# EAGLE schematic GF130nm (EAGLE 9.5.2)
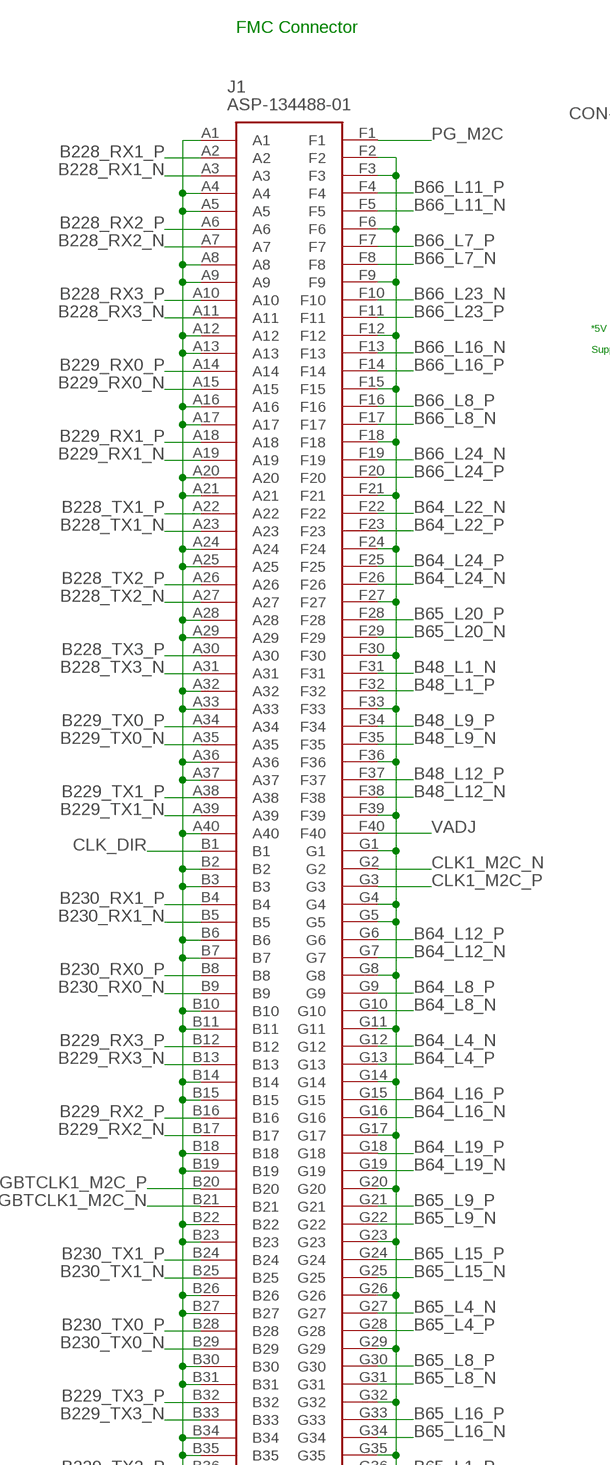
[diagram p0: schematic, sheet 1, part 1 of 3]
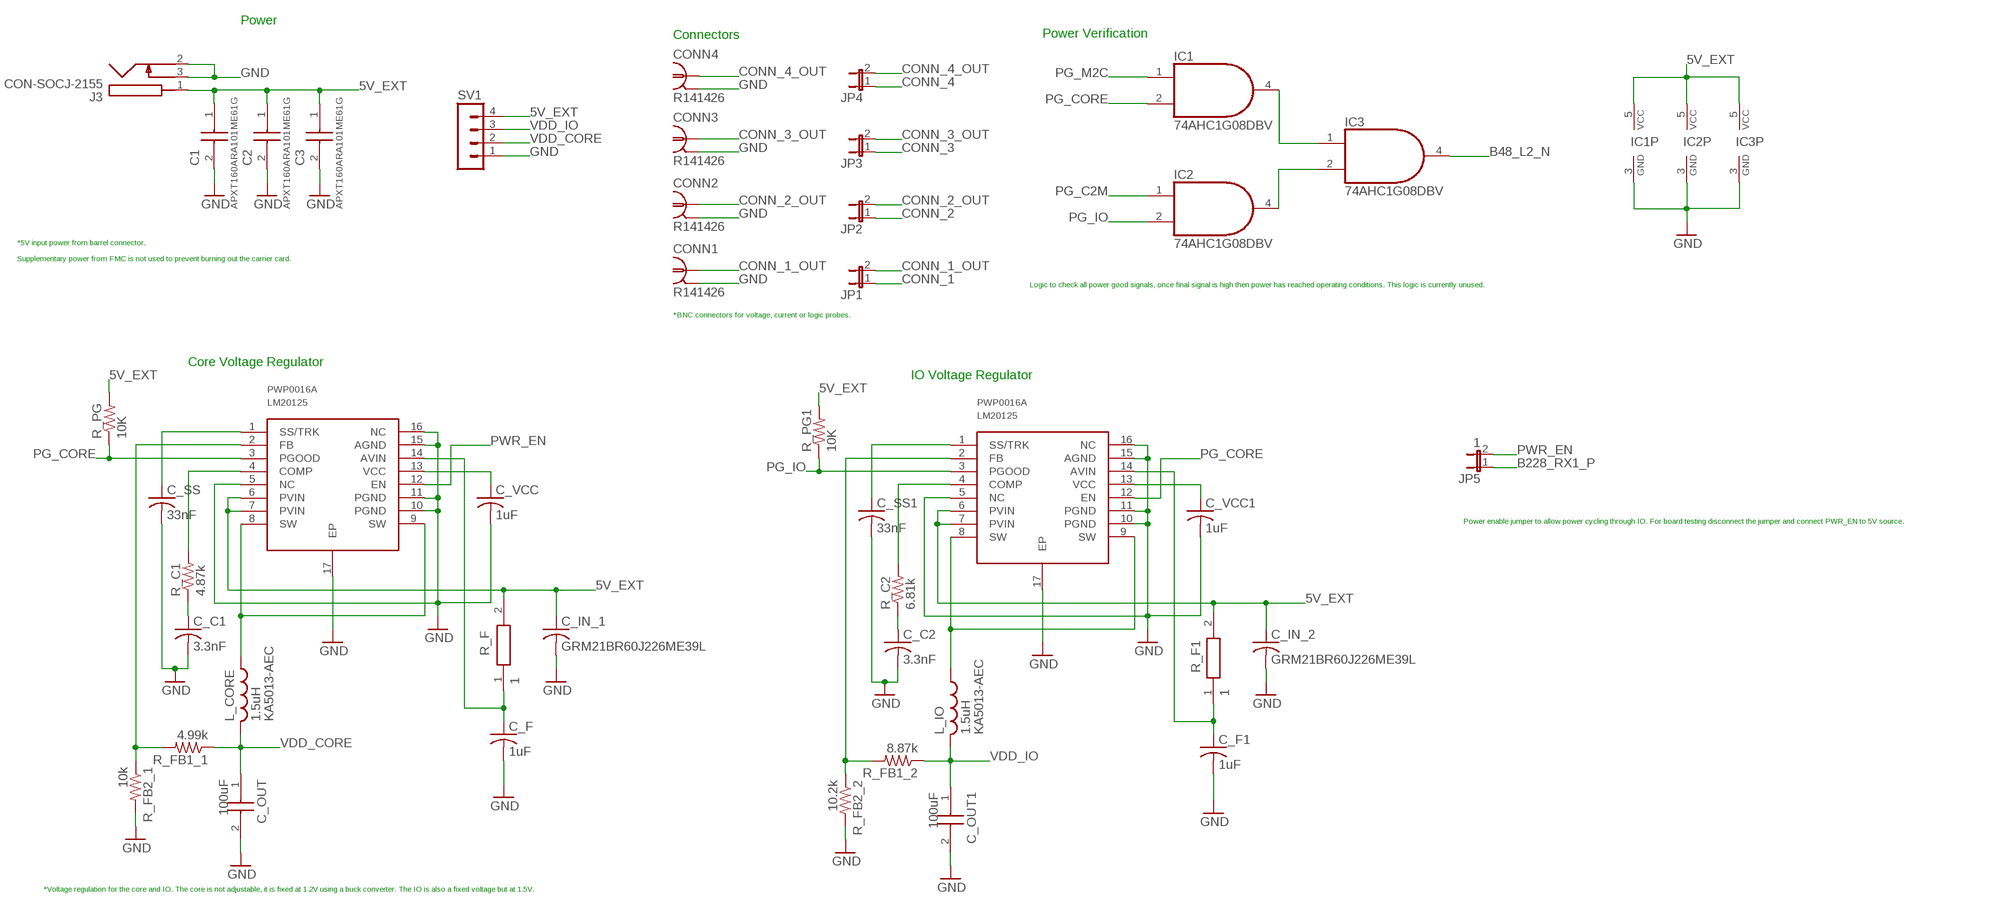
[diagram p1: schematic, sheet 1, part 2 of 3]
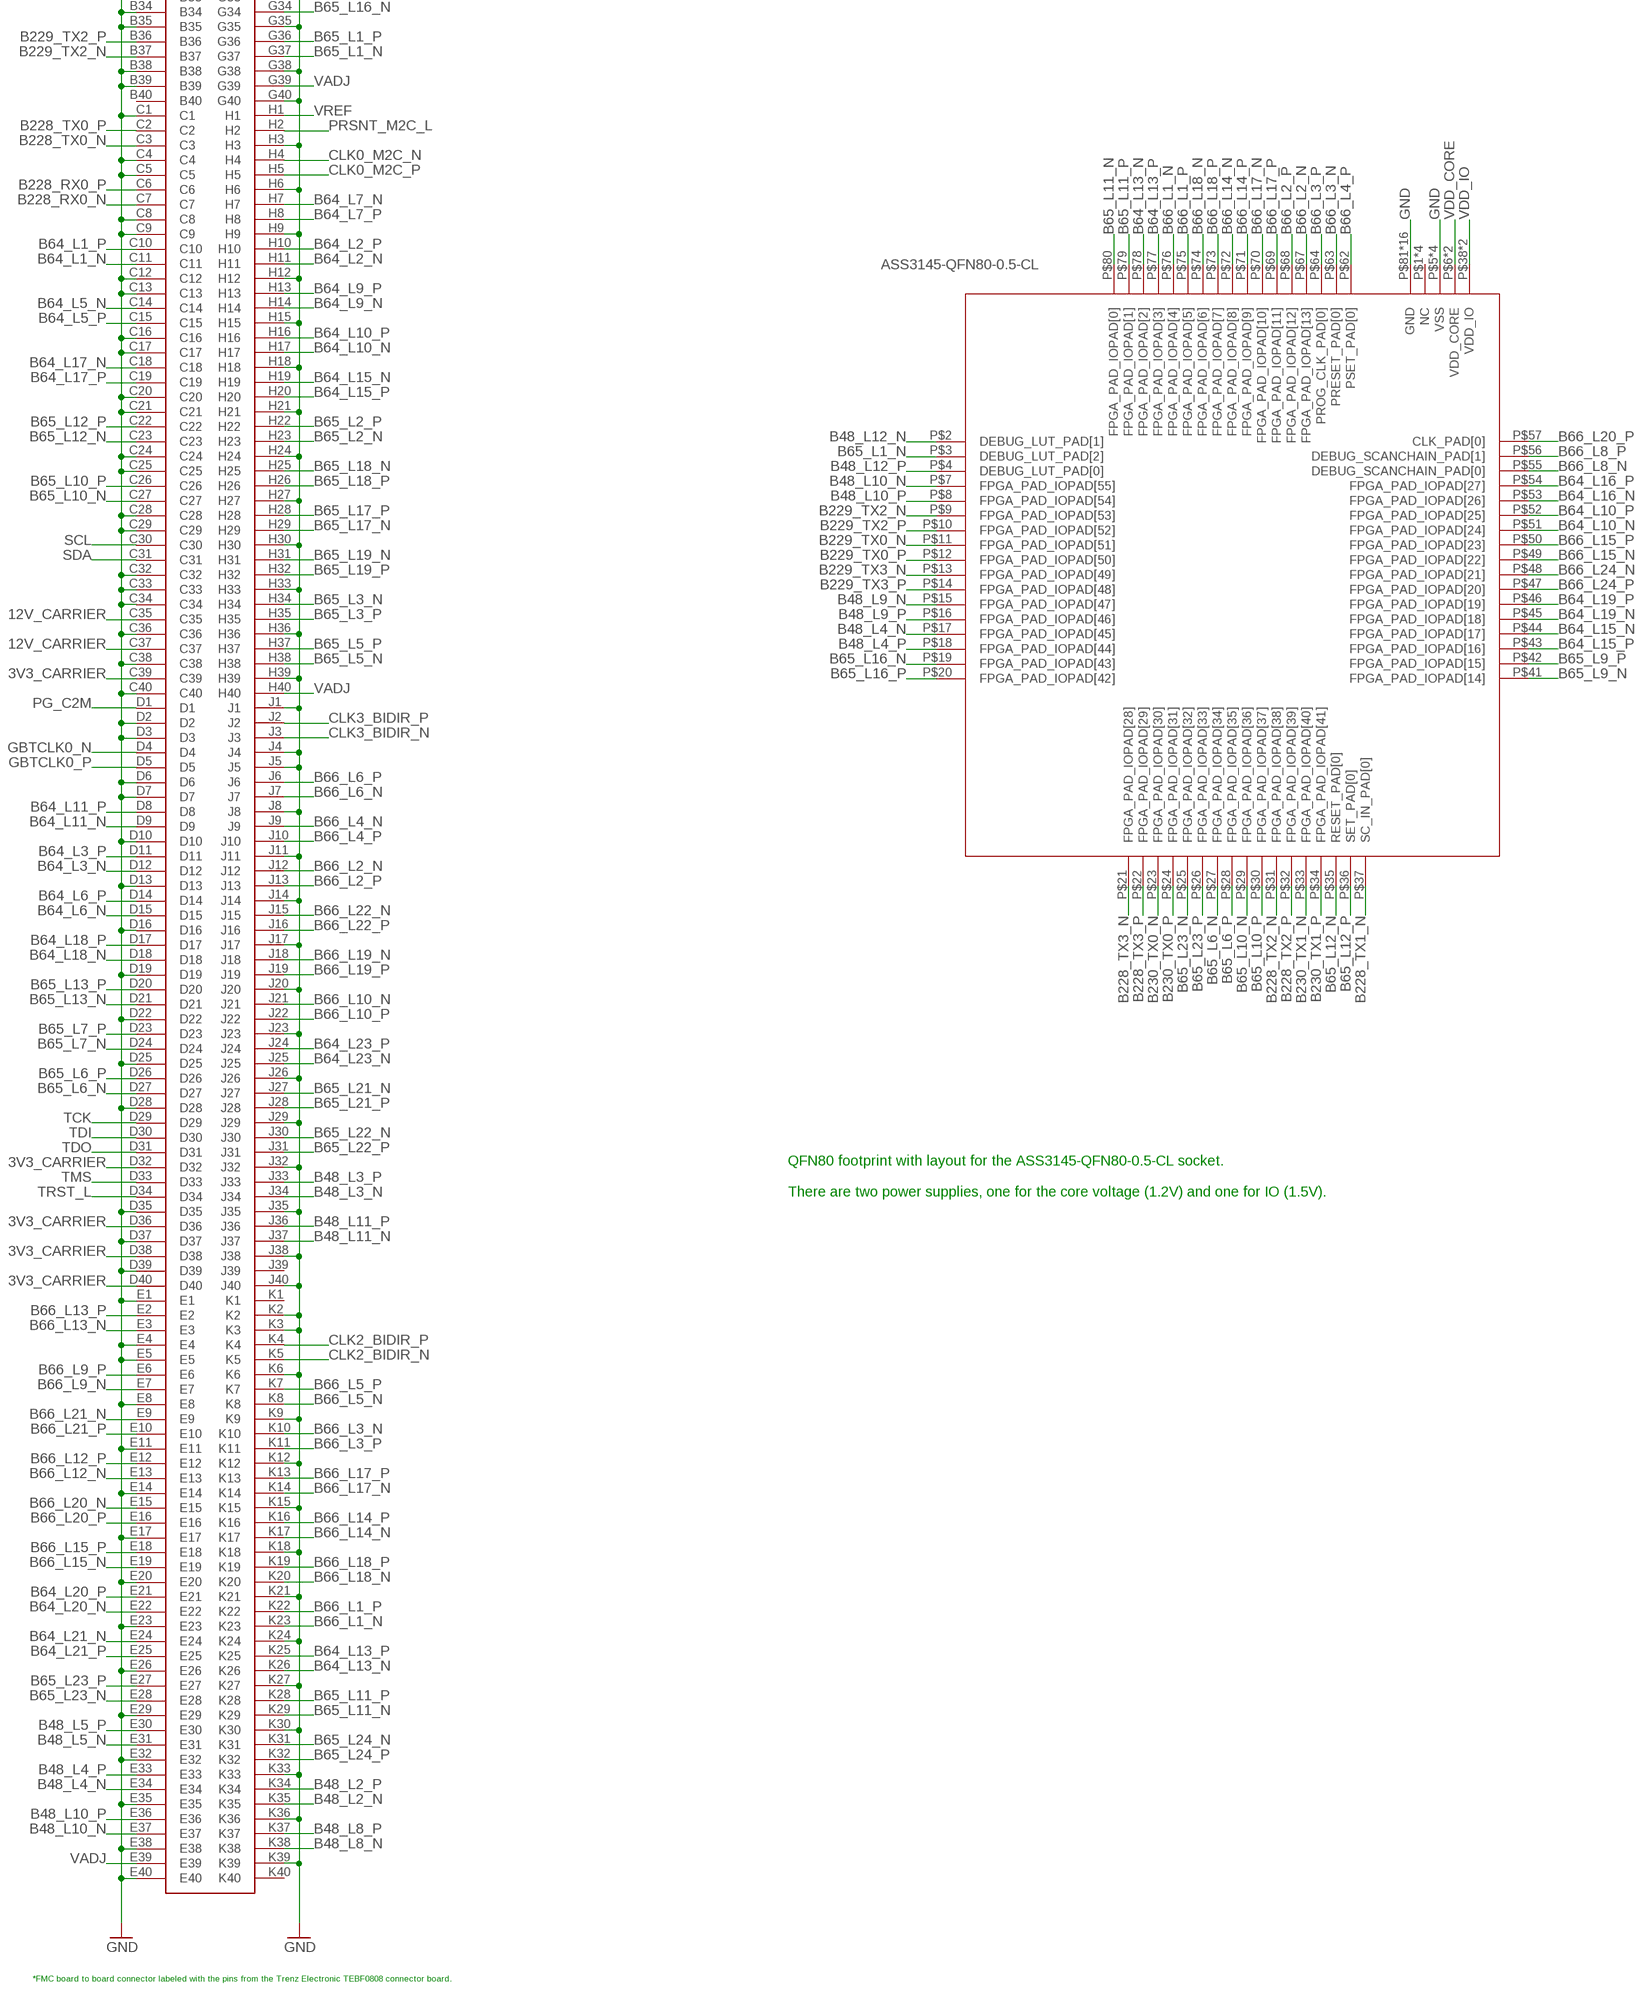
[diagram p2: schematic, sheet 1, part 3 of 3]

## Parts
C1  APXT160ARA101ME61G  [CAPAE530X610N]
C2  APXT160ARA101ME61G  [CAPAE530X610N]
C3  APXT160ARA101ME61G  [CAPAE530X610N]
C_C1  3.3nF  C-USC0805  [C0805]
C_C2  3.3nF  C-USC0805  [C0805]
C_F  1uF  C-USC0805  [C0805]
C_F1  1uF  C-USC0805  [C0805]
C_IN_1  GRM21BR60J226ME39L  [CAPC2012X125N]
C_IN_2  GRM21BR60J226ME39L  [CAPC2012X125N]
C_OUT  100uF  GRM21BR60J107ME15L  [CAPC2012X145N]
C_OUT1  100uF  GRM21BR60J107ME15L  [CAPC2012X145N]
C_SS  33nF  C-USC0805  [C0805]
C_SS1  33nF  C-USC0805  [C0805]
C_VCC  1uF  C-USC0805  [C0805]
C_VCC1  1uF  C-USC0805  [C0805]
CONN1  R141426  [R141426]
CONN2  R141426  [R141426]
CONN3  R141426  [R141426]
CONN4  R141426  [R141426]
IC1  74AHC1G08DBV  [SOT23-5]
IC2  74AHC1G08DBV  [SOT23-5]
IC3  74AHC1G08DBV  [SOT23-5]
J1  ASP-134488-01  [ASP13448801]
J3  CON-SOCJ-2155  [CONSOCJ2155]
JP1  JP1E  [JP1]
JP2  JP1E  [JP1]
JP3  JP1E  [JP1]
JP4  JP1E  [JP1]
JP5  1  JP1E  [JP1]
L_CORE  KA5013-AEC  [INDDFN400X400X180-2N]
L_IO  KA5013-AEC  [INDDFN400X400X180-2N]
R_C1  4.87k  R-US_R0805  [R0805]
R_C2  6.81k  R-US_R0805  [R0805]
R_F  1  RT0603BRD071RL  [RESC1608X55N]
R_F1  1  RT0603BRD071RL  [RESC1608X55N]
R_FB1_1  4.99k  R-US_R0805  [R0805]
R_FB1_2  8.87k  R-US_R0805  [R0805]
R_FB2_1  10k  R-US_R0805  [R0805]
R_FB2_2  10.2k  R-US_R0805  [R0805]
R_PG  10K  R-US_R0805  [R0805]
R_PG1  10K  R-US_R0805  [R0805]
SV1  MA04-1  [MA04-1]
U$2  QFN80  [GF130]
VDD_CORE  LM20125/LM20125Q  [SOP65P640X120-17T330L]
VDD_IO  LM20125/LM20125Q  [SOP65P640X120-17T330L]

## Nets
3V3_CARRIER: J1.C39 J1.D32 J1.D36 J1.D38 J1.D40
5V_EXT: C1.1(+) C2.1(+) C3.1(+) C_IN_1.1 C_IN_2.1 IC1.5(VCC) IC2.5(VCC) IC3.5(VCC) J3.1 R_F1.2 R_F.2 R_PG1.2 R_PG.2 SV1.4 VDD_CORE.6(PVIN) VDD_CORE.7(PVIN) VDD_IO.6(PVIN) VDD_IO.7(PVIN)
12V_CARRIER: J1.C35 J1.C37
B48_L1_N: J1.F31
B48_L1_P: J1.F32
B48_L2_N: IC3.4(O) J1.K35
B48_L2_P: J1.K34
B48_L3_N: J1.J34
B48_L3_P: J1.J33
B48_L4_N: J1.E34 U$2.P$17(FPGA_PAD_IOPAD[45])
B48_L4_P: J1.E33 U$2.P$18(FPGA_PAD_IOPAD[44])
B48_L5_N: J1.E31
B48_L5_P: J1.E30
B48_L8_N: J1.K38
B48_L8_P: J1.K37
B48_L9_N: J1.F35 U$2.P$15(FPGA_PAD_IOPAD[47])
B48_L9_P: J1.F34 U$2.P$16(FPGA_PAD_IOPAD[46])
B48_L10_N: J1.E37 U$2.P$7(FPGA_PAD_IOPAD[55])
B48_L10_P: J1.E36 U$2.P$8(FPGA_PAD_IOPAD[54])
B48_L11_N: J1.J37
B48_L11_P: J1.J36
B48_L12_N: J1.F38 U$2.P$2(DEBUG_LUT_PAD[1])
B48_L12_P: J1.F37 U$2.P$4(DEBUG_LUT_PAD[0])
B64_L1_N: J1.C11
B64_L1_P: J1.C10
B64_L2_N: J1.H11
B64_L2_P: J1.H10
B64_L3_N: J1.D12
B64_L3_P: J1.D11
B64_L4_N: J1.G12
B64_L4_P: J1.G13
B64_L5_N: J1.C14
B64_L5_P: J1.C15
B64_L6_N: J1.D15
B64_L6_P: J1.D14
B64_L7_N: J1.H7
B64_L7_P: J1.H8
B64_L8_N: J1.G10
B64_L8_P: J1.G9
B64_L9_N: J1.H14
B64_L9_P: J1.H13
B64_L10_N: J1.H17 U$2.P$51(FPGA_PAD_IOPAD[24])
B64_L10_P: J1.H16 U$2.P$52(FPGA_PAD_IOPAD[25])
B64_L11_N: J1.D9
B64_L11_P: J1.D8
B64_L12_N: J1.G7
B64_L12_P: J1.G6
B64_L13_N: J1.K26 U$2.P$78(FPGA_PAD_IOPAD[2])
B64_L13_P: J1.K25 U$2.P$77(FPGA_PAD_IOPAD[3])
B64_L15_N: J1.H19 U$2.P$44(FPGA_PAD_IOPAD[17])
B64_L15_P: J1.H20 U$2.P$43(FPGA_PAD_IOPAD[16])
B64_L16_N: J1.G16 U$2.P$53(FPGA_PAD_IOPAD[26])
B64_L16_P: J1.G15 U$2.P$54(FPGA_PAD_IOPAD[27])
B64_L17_N: J1.C18
B64_L17_P: J1.C19
B64_L18_N: J1.D18
B64_L18_P: J1.D17
B64_L19_N: J1.G19 U$2.P$45(FPGA_PAD_IOPAD[18])
B64_L19_P: J1.G18 U$2.P$46(FPGA_PAD_IOPAD[19])
B64_L20_N: J1.E22
B64_L20_P: J1.E21
B64_L21_N: J1.E24
B64_L21_P: J1.E25
B64_L22_N: J1.F22
B64_L22_P: J1.F23
B64_L23_N: J1.J25
B64_L23_P: J1.J24
B64_L24_N: J1.F26
B64_L24_P: J1.F25
B65_L1_N: J1.G37 U$2.P$3(DEBUG_LUT_PAD[2])
B65_L1_P: J1.G36
B65_L2_N: J1.H23
B65_L2_P: J1.H22
B65_L3_N: J1.H34
B65_L3_P: J1.H35
B65_L4_N: J1.G27
B65_L4_P: J1.G28
B65_L5_N: J1.H38
B65_L5_P: J1.H37
B65_L6_N: J1.D27 U$2.P$27(FPGA_PAD_IOPAD[34])
B65_L6_P: J1.D26 U$2.P$28(FPGA_PAD_IOPAD[35])
B65_L7_N: J1.D24
B65_L7_P: J1.D23
B65_L8_N: J1.G31
B65_L8_P: J1.G30
B65_L9_N: J1.G22 U$2.P$41(FPGA_PAD_IOPAD[14])
B65_L9_P: J1.G21 U$2.P$42(FPGA_PAD_IOPAD[15])
B65_L10_N: J1.C27 U$2.P$29(FPGA_PAD_IOPAD[36])
B65_L10_P: J1.C26 U$2.P$30(FPGA_PAD_IOPAD[37])
B65_L11_N: J1.K29 U$2.P$80(FPGA_PAD_IOPAD[0])
B65_L11_P: J1.K28 U$2.P$79(FPGA_PAD_IOPAD[1])
B65_L12_N: J1.C23 U$2.P$35(RESET_PAD[0])
B65_L12_P: J1.C22 U$2.P$36(SET_PAD[0])
B65_L13_N: J1.D21
B65_L13_P: J1.D20
B65_L15_N: J1.G25
B65_L15_P: J1.G24
B65_L16_N: J1.G34 U$2.P$19(FPGA_PAD_IOPAD[43])
B65_L16_P: J1.G33 U$2.P$20(FPGA_PAD_IOPAD[42])
B65_L17_N: J1.H29
B65_L17_P: J1.H28
B65_L18_N: J1.H25
B65_L18_P: J1.H26
B65_L19_N: J1.H31
B65_L19_P: J1.H32
B65_L20_N: J1.F29
B65_L20_P: J1.F28
B65_L21_N: J1.J27
B65_L21_P: J1.J28
B65_L22_N: J1.J30
B65_L22_P: J1.J31
B65_L23_N: J1.E28 U$2.P$25(FPGA_PAD_IOPAD[32])
B65_L23_P: J1.E27 U$2.P$26(FPGA_PAD_IOPAD[33])
B65_L24_N: J1.K31
B65_L24_P: J1.K32
B66_L1_N: J1.K23 U$2.P$76(FPGA_PAD_IOPAD[4])
B66_L1_P: J1.K22 U$2.P$75(FPGA_PAD_IOPAD[5])
B66_L2_N: J1.J12 U$2.P$67(FPGA_PAD_IOPAD[13])
B66_L2_P: J1.J13 U$2.P$68(FPGA_PAD_IOPAD[12])
B66_L3_N: J1.K10 U$2.P$63(PRESET_PAD[0])
B66_L3_P: J1.K11 U$2.P$64(PROG_CLK_PAD[0])
B66_L4_N: J1.J9
B66_L4_P: J1.J10 U$2.P$62(PSET_PAD[0])
B66_L5_N: J1.K8
B66_L5_P: J1.K7
B66_L6_N: J1.J7
B66_L6_P: J1.J6
B66_L7_N: J1.F8
B66_L7_P: J1.F7
B66_L8_N: J1.F17 U$2.P$55(DEBUG_SCANCHAIN_PAD[0])
B66_L8_P: J1.F16 U$2.P$56(DEBUG_SCANCHAIN_PAD[1])
B66_L9_N: J1.E7
B66_L9_P: J1.E6
B66_L10_N: J1.J21
B66_L10_P: J1.J22
B66_L11_N: J1.F5
B66_L11_P: J1.F4
B66_L12_N: J1.E13
B66_L12_P: J1.E12
B66_L13_N: J1.E3
B66_L13_P: J1.E2
B66_L14_N: J1.K17 U$2.P$72(FPGA_PAD_IOPAD[8])
B66_L14_P: J1.K16 U$2.P$71(FPGA_PAD_IOPAD[9])
B66_L15_N: J1.E19 U$2.P$49(FPGA_PAD_IOPAD[22])
B66_L15_P: J1.E18 U$2.P$50(FPGA_PAD_IOPAD[23])
B66_L16_N: J1.F13
B66_L16_P: J1.F14
B66_L17_N: J1.K14 U$2.P$70(FPGA_PAD_IOPAD[10])
B66_L17_P: J1.K13 U$2.P$69(FPGA_PAD_IOPAD[11])
B66_L18_N: J1.K20 U$2.P$74(FPGA_PAD_IOPAD[6])
B66_L18_P: J1.K19 U$2.P$73(FPGA_PAD_IOPAD[7])
B66_L19_N: J1.J18
B66_L19_P: J1.J19
B66_L20_N: J1.E15
B66_L20_P: J1.E16 U$2.P$57(CLK_PAD[0])
B66_L21_N: J1.E9
B66_L21_P: J1.E10
B66_L22_N: J1.J15
B66_L22_P: J1.J16
B66_L23_N: J1.F10
B66_L23_P: J1.F11
B66_L24_N: J1.F19 U$2.P$48(FPGA_PAD_IOPAD[21])
B66_L24_P: J1.F20 U$2.P$47(FPGA_PAD_IOPAD[20])
B228_RX0_N: J1.C7
B228_RX0_P: J1.C6
B228_RX1_N: J1.A3
B228_RX1_P: J1.A2 JP5.1
B228_RX2_N: J1.A7
B228_RX2_P: J1.A6
B228_RX3_N: J1.A11
B228_RX3_P: J1.A10
B228_TX0_N: J1.C3
B228_TX0_P: J1.C2
B228_TX1_N: J1.A23 U$2.P$37(SC_IN_PAD[0])
B228_TX1_P: J1.A22
B228_TX2_N: J1.A27 U$2.P$31(FPGA_PAD_IOPAD[38])
B228_TX2_P: J1.A26 U$2.P$32(FPGA_PAD_IOPAD[39])
B228_TX3_N: J1.A31 U$2.P$21(FPGA_PAD_IOPAD[28])
B228_TX3_P: J1.A30 U$2.P$22(FPGA_PAD_IOPAD[29])
B229_RX0_N: J1.A15
B229_RX0_P: J1.A14
B229_RX1_N: J1.A19
B229_RX1_P: J1.A18
B229_RX2_N: J1.B17
B229_RX2_P: J1.B16
B229_RX3_N: J1.B13
B229_RX3_P: J1.B12
B229_TX0_N: J1.A35 U$2.P$11(FPGA_PAD_IOPAD[51])
B229_TX0_P: J1.A34 U$2.P$12(FPGA_PAD_IOPAD[50])
B229_TX1_N: J1.A39
B229_TX1_P: J1.A38
B229_TX2_N: J1.B37 U$2.P$9(FPGA_PAD_IOPAD[53])
B229_TX2_P: J1.B36 U$2.P$10(FPGA_PAD_IOPAD[52])
B229_TX3_N: J1.B33 U$2.P$13(FPGA_PAD_IOPAD[49])
B229_TX3_P: J1.B32 U$2.P$14(FPGA_PAD_IOPAD[48])
B230_RX0_N: J1.B9
B230_RX0_P: J1.B8
B230_RX1_N: J1.B5
B230_RX1_P: J1.B4
B230_TX0_N: J1.B29 U$2.P$23(FPGA_PAD_IOPAD[30])
B230_TX0_P: J1.B28 U$2.P$24(FPGA_PAD_IOPAD[31])
B230_TX1_N: J1.B25 U$2.P$33(FPGA_PAD_IOPAD[40])
B230_TX1_P: J1.B24 U$2.P$34(FPGA_PAD_IOPAD[41])
CLK0_M2C_N: J1.H4
CLK0_M2C_P: J1.H5
CLK1_M2C_N: J1.G2
CLK1_M2C_P: J1.G3
CLK2_BIDIR_N: J1.K5
CLK2_BIDIR_P: J1.K4
CLK3_BIDIR_N: J1.J3
CLK3_BIDIR_P: J1.J2
CLK_DIR: J1.B1
CONN_1: JP1.1
CONN_1_OUT: CONN1.1 JP1.2
CONN_2: JP2.1
CONN_2_OUT: CONN2.1 JP2.2
CONN_3: JP3.1
CONN_3_OUT: CONN3.1 JP3.2
CONN_4: JP4.1
CONN_4_OUT: CONN4.1 JP4.2
FB: R_FB1_2.2 R_FB2_2.1 VDD_IO.2(FB)
GBTCLK0_N: J1.D4
GBTCLK0_P: J1.D5
GBTCLK1_M2C_N: J1.B21
GBTCLK1_M2C_P: J1.B20
GND: C1.2(-) C2.2(-) C3.2(-) C_C1.2 C_C2.2 C_F1.2 C_F.2 C_IN_1.2 C_IN_2.2 C_OUT1.2 C_OUT.2 C_SS1.2 C_SS.2 C_VCC1.2 C_VCC.2 CONN1.2 CONN1.3 CONN1.4 CONN1.5 CONN2.2 CONN2.3 CONN2.4 CONN2.5 CONN3.2 CONN3.3 CONN3.4 CONN3.5 CONN4.2 CONN4.3 CONN4.4 CONN4.5 IC1.3(GND) IC2.3(GND) IC3.3(GND) J1.A1 J1.A4 J1.A5 J1.A8 J1.A9 J1.A12 J1.A13 J1.A16 J1.A17 J1.A20 J1.A21 J1.A24 J1.A25 J1.A28 J1.A29 J1.A32 J1.A33 J1.A36 J1.A37 J1.A40 J1.B2 J1.B3 J1.B6 J1.B7 J1.B10 J1.B11 J1.B14 J1.B15 J1.B18 J1.B19 J1.B22 J1.B23 J1.B26 J1.B27 J1.B30 J1.B31 J1.B34 J1.B35 J1.B38 J1.B39 J1.C1 J1.C4 J1.C5 J1.C8 J1.C9 J1.C12 J1.C13 J1.C16 J1.C17 J1.C20 J1.C21 J1.C24 J1.C25 J1.C28 J1.C29 J1.C32 J1.C33 J1.C34 J1.C36 J1.C38 J1.C40 J1.D2 J1.D3 J1.D6 J1.D7 J1.D10 J1.D13 J1.D16 J1.D19 J1.D22 J1.D25 J1.D28 J1.D35 J1.D37 J1.D39 J1.E1 J1.E4 J1.E5 J1.E8 J1.E11 J1.E14 J1.E17 J1.E20 J1.E23 J1.E26 J1.E29 J1.E32 J1.E35 J1.E38 J1.E40 J1.F2 J1.F3 J1.F6 J1.F9 J1.F12 J1.F15 J1.F18 J1.F21 J1.F24 J1.F27 J1.F30 J1.F33 J1.F36 J1.F39 J1.G1 J1.G4 J1.G5 J1.G8 J1.G11 J1.G14 J1.G17 J1.G20 J1.G23 J1.G26 J1.G29 J1.G32 J1.G35 J1.G38 J1.G40 J1.H3 J1.H6 J1.H9 J1.H12 J1.H15 J1.H18 J1.H21 J1.H24 J1.H27 J1.H30 J1.H33 J1.H36 J1.H39 J1.J1 J1.J4 J1.J5 J1.J8 J1.J11 J1.J14 J1.J17 J1.J20 J1.J23 J1.J26 J1.J29 J1.J32 J1.J35 J1.J38 J1.J40 J1.K2 J1.K3 J1.K6 J1.K9 J1.K12 J1.K15 J1.K18 J1.K21 J1.K24 J1.K27 J1.K30 J1.K33 J1.K36 J1.K39 J3.2 J3.3 R_FB2_1.2 R_FB2_2.2 SV1.1 U$2.P$5(VSS) U$2.P$39(VSS) U$2.P$59(VSS) U$2.P$65(VSS) U$2.P$81(GND) U$2.P$82(GND) U$2.P$83(GND) U$2.P$84(GND) U$2.P$85(GND) U$2.P$86(GND) U$2.P$87(GND) U$2.P$88(GND) U$2.P$89(GND) U$2.P$90(GND) U$2.P$91(GND) U$2.P$92(GND) U$2.P$93(GND) U$2.P$94(GND) U$2.P$95(GND) U$2.P$96(GND) VDD_CORE.5(NC) VDD_CORE.10(PGND) VDD_CORE.11(PGND) VDD_CORE.15(AGND) VDD_CORE.16(NC) VDD_CORE.17(EP) VDD_IO.5(NC) VDD_IO.10(PGND) VDD_IO.11(PGND) VDD_IO.15(AGND) VDD_IO.16(NC) VDD_IO.17(EP)
N$1: R_C2.2 VDD_IO.4(COMP)
N$2: C_SS.1 VDD_CORE.1(SS/TRK)
N$3: R_C1.2 VDD_CORE.4(COMP)
N$4: C_C1.1 R_C1.1
N$5: C_VCC.1 VDD_CORE.13(VCC)
N$6: C_C2.1 R_C2.1
N$7: L_CORE.1 VDD_CORE.8(SW) VDD_CORE.9(SW)
N$8: C_VCC1.1 VDD_IO.13(VCC)
N$9: C_SS1.1 VDD_IO.1(SS/TRK)
N$10: L_IO.1 VDD_IO.8(SW) VDD_IO.9(SW)
N$11: C_F1.1 R_F1.1 VDD_IO.14(AVIN)
N$12: C_F.1 R_F.1 VDD_CORE.14(AVIN)
N$13: R_FB1_1.2 R_FB2_1.1 VDD_CORE.2(FB)
N$15: IC1.4(O) IC3.1(I0)
N$16: IC2.4(O) IC3.2(I1)
PG_C2M: IC2.1(I0) J1.D1
PG_CORE: IC1.2(I1) R_PG.1 VDD_CORE.3(PGOOD) VDD_IO.12(EN)
PG_IO: IC2.2(I1) R_PG1.1 VDD_IO.3(PGOOD)
PG_M2C: IC1.1(I0) J1.F1
PRSNT_M2C_L: J1.H2
PWR_EN: JP5.2 VDD_CORE.12(EN)
SCL: J1.C30
SDA: J1.C31
TCK: J1.D29
TDI: J1.D30
TDO: J1.D31
TMS: J1.D33
TRST_L: J1.D34
VADJ: J1.E39 J1.F40 J1.G39 J1.H40
VDD_CORE: C_OUT.1 L_CORE.2 R_FB1_1.1 SV1.2 U$2.P$6(VDD_CORE) U$2.P$58(VDD_CORE)
VDD_IO: C_OUT1.1 L_IO.2 R_FB1_2.1 SV1.3 U$2.P$38(VDD_IO) U$2.P$66(VDD_IO)
VREF: J1.H1
Unconnected: J1.B40 J1.J39 J1.K1 J1.K40 U$2.P$1(NC) U$2.P$40(NC) U$2.P$60(NC) U$2.P$61(NC)

## Notes on the sheet
- FMC Connector | Power
- Connectors | Power Verification
- *5V input power from barrel connector.
  
  Supplementary power from FMC is not used to prevent burning out the carrier card.
- Logic to check all power good signals, once final signal is high then power has reached operating conditions. This logic is currently unused.
- *BNC connectors for voltage, current or logic probes.
- Core Voltage Regulator
- IO Voltage Regulator
- Power enable jumper to allow power cycling through IO. For board testing disconnect the jumper and connect PWR_EN to 5V source.
- *Voltage regulation for the core and IO. The core is not adjustable, it is fixed at 1.2V using a buck converter. The IO is also a fixed voltage but at 1.5V.
- QFN80 footprint with layout for the ASS3145-QFN80-0.5-CL socket. 
  
  There are two power supplies, one for the core voltage (1.2V) and one for IO (1.5V).
- *FMC board to board connector labeled with the pins from the Trenz Electronic TEBF0808 connector board.

## Library data of the parts
C1-C3 = SamacSys_Parts:APXT160ARA101ME61G: Aluminum Organic Polymer Capacitors 100uF 16V Source: Datasheet; DESCRIPTION: Aluminum Organic Polymer Capacitors 100uF 16V; HEIGHT: 6.1mm; MANUFACTURER_NAME: United Chemi-Con; MANUFACTURER_PART_NUMBER: APXT160ARA101ME61G; MOUSER_PART_NUMBER: 661-APXT160A101ME61G; MOUSER_PRICE-STOCK: https://www.mouser.co.uk/ProductDetail/United-Chemi-Con/APXT160ARA101ME61G?qs=GBLSl2Akirsip577GuQBxg%3D%3D
C_C1 C_C2 C_F C_F1 C_SS C_SS1 C_VCC C_VCC1 = adafruit:C-US: CAPACITOR, American symbol
C_IN_1 C_IN_2 = GRM21BR60J226ME39L:GRM21BR60J226ME39L
C_OUT C_OUT1 = SamacSys_Parts:GRM21BR60J107ME15L: Multilayer Ceramic Capacitors MLCC - SMD/SMT 100UF 6.3V 20% 0805 Source: Datasheet <https://psearch.en.murata.com/capacitor/product/GRM21BR60J107ME15#.html>; DESCRIPTION: Multilayer Ceramic Capacitors MLCC - SMD/SMT 100UF 6.3V 20% 0805; HEIGHT: 1.45mm; MANUFACTURER_NAME: Murata Electronics; MANUFACTURER_PART_NUMBER: GRM21BR60J107ME15L; MOUSER_PART_NUMBER: 81-GRM21BR60J107ME5L; MOUSER_PRICE-STOCK: https://www.mouser.co.uk/ProductDetail/Murata-Electronics/GRM21BR60J107ME15L?qs=qSv5qXjCIG0V4cgMTBuIkA%3D%3D
CONN1 = con-coax:R141426: BNC COAX CONNECTOR Radiall 50/75 Ohm Spoerle; MF: FARNELL; MPN: R141426161; OC_FARNELL: 4195115; OC_NEWARK: 14J7919; SPICEPREFIX: X
CONN2-CONN4 = con-coax:R141426: BNC COAX CONNECTOR Radiall 50/75 Ohm Spoerle; MF: FARNELL; MPN: R141426161; OC_FARNELL: 4195115; OC_NEWARK: 14J7919
IC1-IC3 = 74xx-little-us:74*1G08: 2-input AND gate
J1 = SamacSys_Parts:ASP-134488-01: SAMTEC - ASP-134488-01 - CONN, VITA 57 FMC, HEADER, 400POS, 10ROW Source: Datasheet <http://suddendocs.samtec.com/prints/asp-134488-01-mkt.pdf>; DESCRIPTION: SAMTEC - ASP-134488-01 - CONN, VITA 57 FMC, HEADER, 400POS, 10ROW; HEIGHT: 7.11mm; MANUFACTURER_NAME: SAMTEC; MANUFACTURER_PART_NUMBER: ASP-134488-01; MOUSER_PART_NUMBER: 200-ASP-134488-01; MOUSER_PRICE-STOCK: https://www.mouser.co.uk/ProductDetail/Samtec/ASP-134488-01?qs=jyzYFa4oMQiB2Frr%252B13AUg%3D%3D
J3 = SamacSys_Parts:CON-SOCJ-2155: DC Power Connectors Power Jack/Connector 2.1mm x 5.5mm Source: Datasheet <http://www.produktinfo.conrad.com/datenblaetter/1500000-1599999/001582350-da-01-en-DC_EINBAUBUCHSE__SCHALTER_GESCHLOSSEN.pdf>; DESCRIPTION: DC Power Connectors Power Jack/Connector 2.1mm x 5.5mm; HEIGHT: 11mm; MANUFACTURER_NAME: Gravitech; MANUFACTURER_PART_NUMBER: CON-SOCJ-2155; MOUSER_PART_NUMBER: 992-CON-SOCJ-2155; MOUSER_PRICE-STOCK: https://www.mouser.co.uk/ProductDetail/Gravitech/CON-SOCJ-2155/?qs=fkzBJ5HM%252BdCcpvFQyQZHtA%3D%3D
JP1-JP5 = jumper:JP1E: JUMPER
L_CORE L_IO = KA513-AEC:KA5013-AEC
R_C1 R_C2 R_FB1_1 R_FB1_2 R_FB2_1 R_FB2_2 R_PG R_PG1 = rcl:R-US_: RESISTOR, American symbol; SPICEPREFIX: R
R_F R_F1 = SamacSys_Parts:RT0603BRD071RL: Thin Film Resistors - SMD 1 ohm 0.1% 25 ppm High-Precision Source: Datasheet <https://componentsearchengine.com/Datasheets/1/RT0603BRD071RL.pdf>; DESCRIPTION: Thin Film Resistors - SMD 1 ohm 0.1% 25 ppm High-Precision; HEIGHT: 0.55mm; MANUFACTURER_NAME: YAGEO (PHYCOMP); MANUFACTURER_PART_NUMBER: RT0603BRD071RL; MOUSER_PART_NUMBER: 603-RT0603BRD071RL; MOUSER_PRICE-STOCK: https://www.mouser.com/Search/Refine.aspx?Keyword=603-RT0603BRD071RL
SV1 = con-lstb:MA04-1: PIN HEADER; OC_FARNELL: unknown; OC_NEWARK: unknown
U$2 = ASS3145-QFN80-0.5-CL:QFN80
VDD_CORE VDD_IO = LM20125:LM20125/LM20125Q